# Altium schematic sheet current_sense.SchDoc
size A
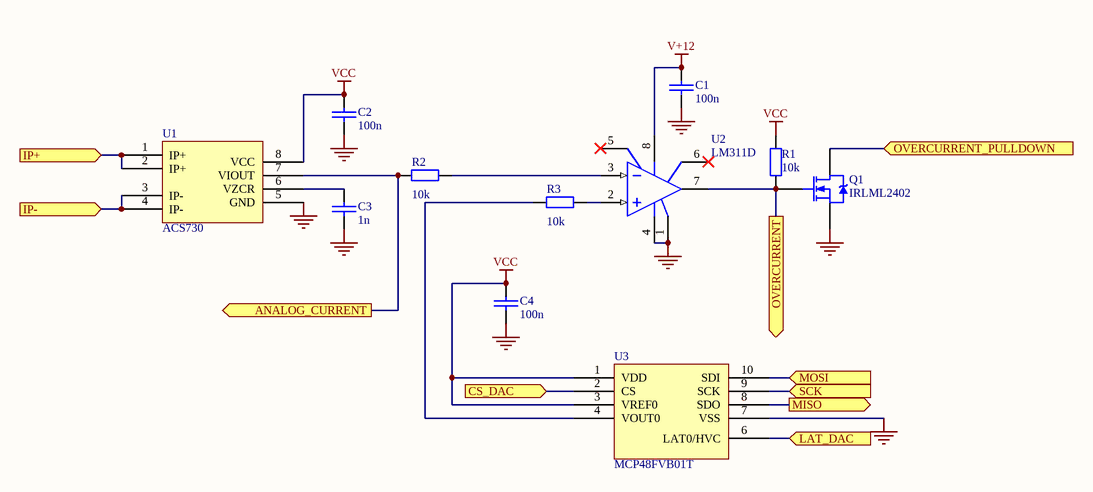
[diagram p0: current_sense.SchDoc]

## Parts
C1  100n  [CAPC1608N]
C2  100n  [CAPC1608N]
C3  1n  [CAPC1608N]
C4  100n  [CAPC1608N]
Q1  IRLML2402  [SOT-23_N]
R1  10k  [RESC1608N]
R2  10k  [RESC1608N]
R3  10k  [RESC1608N]
U1  ACS730
U2  LM311D  [SO8_N]
U3  MCP48FVB01T

## Ports
ANALOG_CURRENT (out), CS_DAC (in), IP+ (in), IP- (in), LAT_DAC (in), MISO (out), MOSI (in), OVERCURRENT (out), OVERCURRENT_PULLDOWN (in), SCK (in)

## Nets
GND: C1.1 C2.1 C3.1 C4.1 Q1.2(S) U1.5(GND) U2.1(GND) U2.4(V-_(CASE)) U3.7(VSS)
V+12: C1.2 U2.8(V+)
VCC: C2.2 C4.2 R1.2 U1.8(VCC) U3.1(VDD) U3.3(VREF0)
ANALOG_CURRENT: R2.1 U1.7(VIOUT) ; port ANALOG_CURRENT
CS_DAC: U3.2(CS) ; port CS_DAC
IP+: U1.1(IP+) U1.2(IP+) ; port IP+
IP-: U1.3(IP-) U1.4(IP-) ; port IP-
LAT_DAC: U3.6(LAT0/HVC) ; port LAT_DAC
MISO: U3.8(SDO) ; port MISO
MOSI: U3.10(SDI) ; port MOSI
OVERCURRENT: Q1.1(G) R1.1 U2.7(OUT) ; port OVERCURRENT
OVERCURRENT_PULLDOWN: Q1.3(D) ; port OVERCURRENT_PULLDOWN
SCK: U3.9(SCK) ; port SCK
NetC3_2: C3.2 U1.6(VZCR)
NetR2_2: R2.2 U2.3(IN-)
NetR3_1: R3.1 U3.4(VOUT0)
NetR3_2: R3.2 U2.2(IN+)

Not connected (* = marked no-connect by the designer): U2 5(BAL)* 6(BAL/STB)*

## Library data of the parts
C1-C4 = CAP: Capacitor
Q1 = IRLML2402: HEXFET Power MOSFET; Published: 8-Jun-2000; LatestRevisionDate: 20-Nov-2009; LatestRevisionNote: IPC-7351 Footprint Added.; DatasheetVersion: Aug-1997; PackageReference: SOT-23; Publisher: Altium Limited; PackageDescription: 3-Pin SOT-23 Package 0.95 mm Pitch, 2.3 mm Lead Span; ComponentLink1Description: Manufacturer Link; ComponentLink1URL: http://www.irf.com/; ComponentLink2Description: Datasheet; ComponentLink2URL: http://www.irf.com/product-info/datasheets/data/irlml2402.pdf
R1-R3 = Res2: Resistor; Published: 8-Jun-2000; LatestRevisionDate: 17-Jul-2002; LatestRevisionNote: Re-released for DXP Platform.; PackageReference: AXIAL-0.4; Publisher: Altium Limited; Value: 10k
U2 = LM311D: Voltage Comparator; Published: 24-Aug-2001; LatestRevisionDate: 13-Apr-2006; LatestRevisionNote: IPC-7351 Footprint Added.; DatasheetVersion: Oct-1997; PackageVersion: Dec-2002; PackageReference: SO8; Publisher: Altium Limited; PackageDescription: 8-Pin Small Outline Integrated Circuit 1.27 mm Pitch; Code_JEDEC: MS-012-AA; Code_IPC: SOIC127P600-8; ComponentLink1Description: Manufacturer Link; ComponentLink1URL: http://www.st.com/; ComponentLink2Description: Datasheet; ComponentLink2URL: http://www.st.com/stonline/products/literature/ds/4848/lm211.pdf